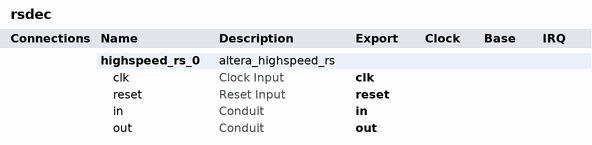
[diagram p0: system contents]
# Platform Designer (Qsys) system rsdec, Arria 10 10AX115U1F45E1SG
# Parameters at their usual value, and those the tool derives, are not listed.
package require -exact qsys 16.1
create_system rsdec
set_project_property DEVICE_FAMILY {Arria 10}
set_project_property DEVICE 10AX115U1F45E1SG

add_instance highspeed_rs_0 altera_highspeed_rs 16.1
set_instance_property highspeed_rs_0 AUTO_EXPORT true
set_instance_parameter_value highspeed_rs_0 BITSPERSYMBOL 10
set_instance_parameter_value highspeed_rs_0 BMSPEED 6
set_instance_parameter_value highspeed_rs_0 CHANNEL 1
set_instance_parameter_value highspeed_rs_0 IRRPOL 1033
set_instance_parameter_value highspeed_rs_0 K 514
set_instance_parameter_value highspeed_rs_0 N 528
set_instance_parameter_value highspeed_rs_0 PAR 8
set_instance_parameter_value highspeed_rs_0 RS Decoder
set_instance_parameter_value highspeed_rs_0 USEECCFORRAM 1
set_instance_parameter_value highspeed_rs_0 USERAM 1
set_instance_parameter_value highspeed_rs_0 USETRUEDUALRAM 0
set_instance_parameter_value highspeed_rs_0 USE_BKP 0
set_instance_parameter_value highspeed_rs_0 USE_BYPASS 0
set_instance_parameter_value highspeed_rs_0 USE_DECFAIL 1
set_instance_parameter_value highspeed_rs_0 USE_ERRORVALUE 0
set_instance_parameter_value highspeed_rs_0 USE_NBERROR 1
set_instance_parameter_value highspeed_rs_0 USE_SOPEOP 1
set_instance_parameter_value highspeed_rs_0 design_env NATIVE
set_instance_parameter_value highspeed_rs_0 selected_device_family {Arria 10}

# exported interfaces
add_interface clk clock sink
set_interface_property clk EXPORT_OF highspeed_rs_0.clk
add_interface in conduit end
set_interface_property in EXPORT_OF highspeed_rs_0.in
add_interface out conduit end
set_interface_property out EXPORT_OF highspeed_rs_0.out
add_interface reset reset sink
set_interface_property reset EXPORT_OF highspeed_rs_0.reset

set_interconnect_requirement {$system} qsys_mm.clockCrossingAdapter HANDSHAKE
set_interconnect_requirement {$system} qsys_mm.enableEccProtection FALSE
set_interconnect_requirement {$system} qsys_mm.insertDefaultSlave FALSE
set_interconnect_requirement {$system} qsys_mm.maxAdditionalLatency 1

save_system rsdec.qsys
